# EAGLE design WS2812B breakout (EAGLE 7.3.0)
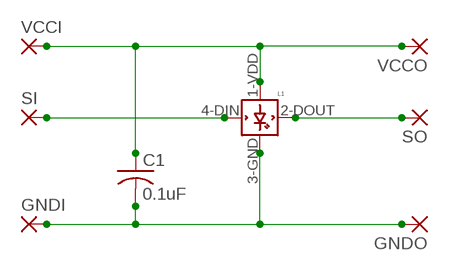
[diagram p0: schematic, sheet 1]

## Parts
C1  0.1uF  C-USC0402K  [C0402K]
GNDI  SMD2  [SMD1,27-2,54]
GNDO  SMD2  [SMD1,27-2,54]
L1  WS2812B  [WS2812B]
SI  SMD2  [SMD1,27-2,54]
SO  SMD2  [SMD1,27-2,54]
VCCI  SMD2  [SMD1,27-2,54]
VCCO  SMD2  [SMD1,27-2,54]

## Nets
N$1: C1.2 GNDI.1(P) GNDO.1(P) L1.3-GND(GND)
N$2: C1.1 L1.1-VDD(VDD) VCCI.1(P) VCCO.1(P)
N$3: L1.4-DIN(DIN) SI.1(P)
N$4: L1.2-DOUT(DOUT) SO.1(P)

## Library data of the parts
C1 = adafruit:C-US: CAPACITOR, American symbol
GNDI GNDO SI SO VCCI VCCO = wirepad:SMD2: SMD PAD
L1 = adafruit:WS2812B

## Board
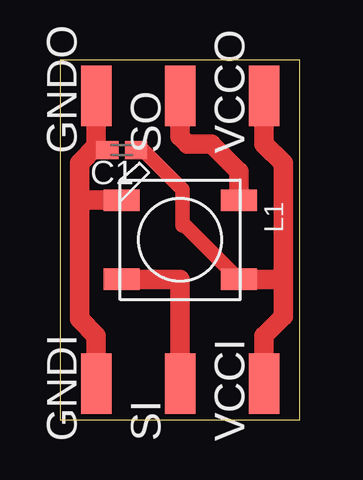
[diagram p1: board, top side]

Size 10 x 15 mm. Coordinates in mm from the lower left corner, seen from the top.
Outline: 0,0 10,0 10,15 0,15 0,0
Copper layers (1*16): Top 0.035mm / dielectric 1.5mm / Bottom 0.035mm
Design rules "default": minimum track width 10mil, minimum drill 24mil, track to track 8mil, track to pad 8mil, pad to pad 8mil, via to via 8mil, smd to smd 8mil, copper to edge 40mil, drill to drill 8mil, minimum pad ring 10mil, minimum via ring 8mil, stop-mask expansion 4mil, vias tented up to drill 0mil, thermal gap 10mil

### Footprints (pad centres in the part's own frame; a part is rotated, then mirrored left to right if it is on the bottom)
C0402K = smd 0.925 x 0.74: 1 -0.6,0; 2 0.6,0
SMD1,27-2,54 = smd 1.27 x 2.54: 1 0,0
WS2812B = smd 1.5 x 0.9: 1-VDD 2.45,-1.65; 2-DOUT 2.45,1.65; 3-GND -2.45,1.65; 4-DIN -2.45,-1.65

### Placement (x,y rotation side)
C1  2.57,11.24 180 top
GNDI  1.5,1.5 0 top
GNDO  1.5,13.5 0 top
L1  5,7.5 0 top
SI  5,1.5 0 top
SO  5,13.5 0 top
VCCI  8.5,1.5 0 top
VCCO  8.5,13.5 0 top

### Tracks (layer width: path | path; a pad name or v marks a point on that pad's centre or on a via)
N$1
  Top 0.61: C1.2 1.66,11.24 1.5,11.4
  Top 0.813: GNDI.1 1.5,3.5 0.8,4.2 0.8,9 | 0.8,9 0.8,10.7 1.5,11.4 GNDO.1 | L1.3-GND 0.95,9.15 0.8,9
N$2
  Top 0.61: C1.1 3.46,11.24 5.1,9.6 5.1,8.1 5.2,8.1 L1.1-VDD
  Top 0.813: VCCI.1 8.5,3.5 9.3,4.3 9.3,5.8 | 9.3,5.8 9.3,10.7 8.5,11.5 VCCO.1 | L1.1-VDD 9.25,5.85 9.3,5.8
N$3
  Top 0.813: L1.4-DIN 5,5.85 SI.1
N$4
  Top 0.813: L1.2-DOUT 7.45,10.35 6.3,11.5 5.3,11.5 5,11.8 SO.1